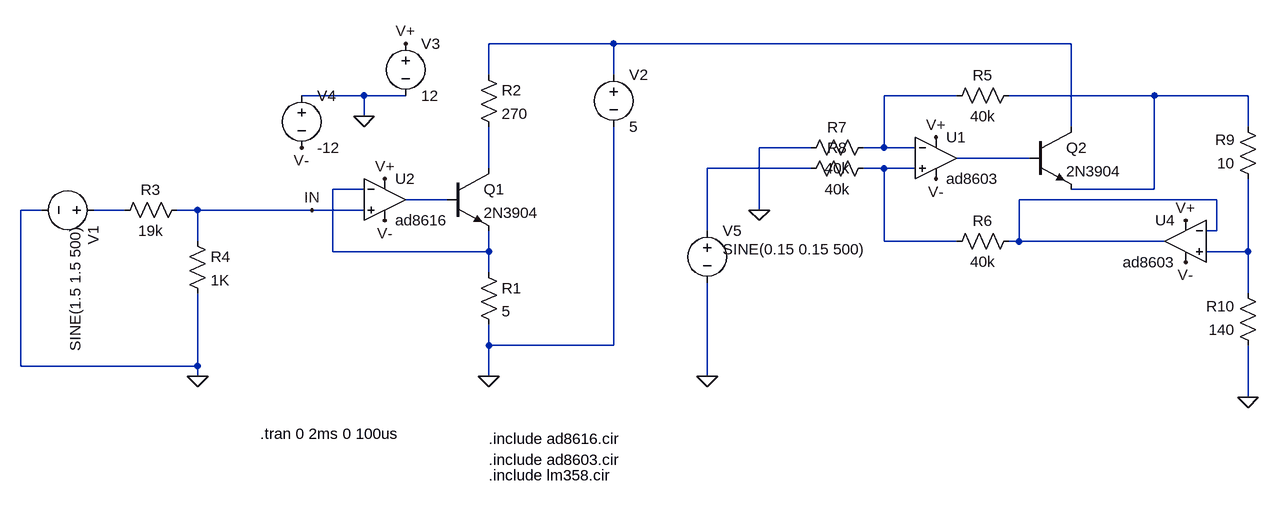
[diagram p0: schematic current_source.asc]
current_source.asc, the LTspice schematic file:
Version 4
SHEET 1 1572 808
WIRE 576 -304 384 -304
WIRE 1280 -304 576 -304
WIRE 384 -256 384 -304
WIRE 576 -256 576 -304
WIRE 192 -224 96 -224
WIRE 256 -224 192 -224
WIRE 1104 -224 992 -224
WIRE 1408 -224 1184 -224
WIRE 1552 -224 1408 -224
WIRE 192 -192 192 -224
WIRE 1280 -176 1280 -304
WIRE 1552 -176 1552 -224
WIRE 880 -144 800 -144
WIRE 992 -144 992 -224
WIRE 992 -144 960 -144
WIRE 1040 -144 992 -144
WIRE 1216 -128 1104 -128
WIRE 384 -112 384 -176
WIRE 880 -112 720 -112
WIRE 992 -112 960 -112
WIRE 1040 -112 992 -112
WIRE 192 -80 144 -80
WIRE 1408 -80 1408 -224
WIRE 1408 -80 1280 -80
WIRE 320 -64 256 -64
WIRE 1504 -64 1200 -64
WIRE -304 -48 -336 -48
WIRE -176 -48 -224 -48
WIRE -64 -48 -96 -48
WIRE 112 -48 -64 -48
WIRE 192 -48 112 -48
WIRE 800 -48 800 -144
WIRE 720 -16 720 -112
WIRE 1504 -16 1504 -64
WIRE 1504 -16 1488 -16
WIRE -64 0 -64 -48
WIRE 992 0 992 -112
WIRE 1104 0 992 0
WIRE 1200 0 1200 -64
WIRE 1200 0 1184 0
WIRE 1424 0 1200 0
WIRE 144 16 144 -80
WIRE 384 16 384 -16
WIRE 384 16 144 16
WIRE 1552 16 1552 -96
WIRE 1552 16 1488 16
WIRE 384 48 384 16
WIRE 1552 80 1552 16
WIRE 384 160 384 128
WIRE 576 160 576 -176
WIRE 576 160 384 160
WIRE -336 192 -336 -48
WIRE -64 192 -64 80
WIRE -64 192 -336 192
WIRE -64 208 -64 192
WIRE 384 208 384 160
WIRE 720 208 720 64
WIRE 1552 240 1552 160
FLAG -64 208 0
FLAG 384 208 0
FLAG 224 -96 V+
FLAG 224 -32 V-
FLAG 256 -304 V+
FLAG 96 -144 V-
FLAG 192 -192 0
FLAG 112 -48 IN
FLAG 1552 240 0
FLAG 800 -48 0
FLAG 1456 -32 V+
FLAG 1456 32 V-
FLAG 720 208 0
FLAG 1072 -160 V+
FLAG 1072 -96 V-
SYMBOL res 368 32 R0
SYMATTR InstName R1
SYMATTR Value 5
SYMBOL res 368 -272 R0
SYMATTR InstName R2
SYMATTR Value 270
SYMBOL npn 320 -112 R0
SYMATTR InstName Q1
SYMATTR Value 2N3904
SYMBOL voltage -208 -48 R90
WINDOW 3 24 44 Left 2
WINDOW 123 24 72 Left 2
WINDOW 39 0 0 Left 2
SYMATTR Value SINE(1.5 1.5 500)
SYMATTR InstName V1
SYMBOL voltage 576 -272 R0
WINDOW 123 0 0 Left 2
WINDOW 39 0 0 Left 2
SYMATTR InstName V2
SYMATTR Value 5
SYMBOL voltage 256 -320 R0
WINDOW 123 0 0 Left 2
WINDOW 39 0 0 Left 2
SYMATTR InstName V3
SYMATTR Value 12
SYMBOL voltage 96 -240 R0
WINDOW 123 0 0 Left 2
WINDOW 39 0 0 Left 2
SYMATTR InstName V4
SYMATTR Value -12
SYMBOL res -80 -64 R90
WINDOW 0 0 56 VBottom 2
WINDOW 3 32 56 VTop 2
SYMATTR InstName R3
SYMATTR Value 19k
SYMBOL res -80 -16 R0
SYMATTR InstName R4
SYMATTR Value 1K
SYMBOL npn 1216 -176 R0
SYMATTR InstName Q2
SYMATTR Value 2N3904
SYMBOL res 1200 -240 R90
WINDOW 0 0 56 VBottom 2
WINDOW 3 32 56 VTop 2
SYMATTR InstName R5
SYMATTR Value 40k
SYMBOL res 1200 -16 R90
WINDOW 0 0 56 VBottom 2
WINDOW 3 32 56 VTop 2
SYMATTR InstName R6
SYMATTR Value 40k
SYMBOL res 976 -160 R90
WINDOW 0 0 56 VBottom 2
WINDOW 3 32 56 VTop 2
SYMATTR InstName R7
SYMATTR Value 40k
SYMBOL res 976 -128 R90
WINDOW 0 0 56 VBottom 2
WINDOW 3 32 56 VTop 2
SYMATTR InstName R8
SYMATTR Value 40k
SYMBOL res 1568 -80 R180
WINDOW 0 36 76 Left 2
WINDOW 3 36 40 Left 2
SYMATTR InstName R9
SYMATTR Value 10
SYMBOL res 1568 176 R180
WINDOW 0 36 76 Left 2
WINDOW 3 36 40 Left 2
SYMATTR InstName R10
SYMATTR Value 140
SYMBOL voltage 720 -32 R0
WINDOW 3 24 44 Left 2
WINDOW 123 24 72 Left 2
WINDOW 39 0 0 Left 2
SYMATTR Value SINE(0.15 0.15 500)
SYMATTR InstName V5
SYMBOL Opamps\\opamp2 1456 -64 M0
SYMATTR InstName U4
SYMATTR Value ad8603
SYMBOL Opamps\\opamp2 1072 -192 R0
SYMATTR InstName U1
SYMATTR Value ad8603
SYMBOL Opamps\\opamp2 224 -128 R0
SYMATTR InstName U2
SYMATTR Value ad8616
TEXT 32 296 Left 2 !.tran 0 2ms 0 100us
TEXT 384 304 Left 2 !.include ad8616.cir
TEXT 384 336 Left 2 !.include ad8603.cir
TEXT 384 360 Left 2 !.include lm358.cir

The netlist it stands for:
* current_source.asc
R1 N008 0 5
R2 N001 N005 270
Q1 N005 N009 N008 0 2N3904
V1 N011 0 SINE(1.5 1.5 500)
V2 N001 0 5
V3 V+ 0 12
V4 0 V- -12
R3 IN N011 19k
R4 IN 0 1K
Q2 N001 N004 N003 0 2N3904
R5 N003 N002 40k
R6 N010 N007 40k
R7 N002 0 40k
R8 N007 N006 40k
R9 N012 N003 10
R10 0 N012 140
V5 N006 0 SINE(0.15 0.15 500)
XU4 N012 N010 V+ V- N010 ad8603  ; pins In+ In- V+ V- OUT
XU1 N007 N002 V+ V- N004 ad8603  ; pins In+ In- V+ V- OUT
XU2 IN N008 V+ V- N009 ad8616  ; pins In+ In- V+ V- OUT
.model NPN NPN
.model PNP PNP
.lib standard.bjt
.tran 0 2ms 0 100us
.include ad8616.cir
.include ad8603.cir
.include lm358.cir
.backanno
.end